# EAGLE schematic i12_TEMPERATURESENSOR-v03(3_4)OHW (EAGLE 6.5.0)
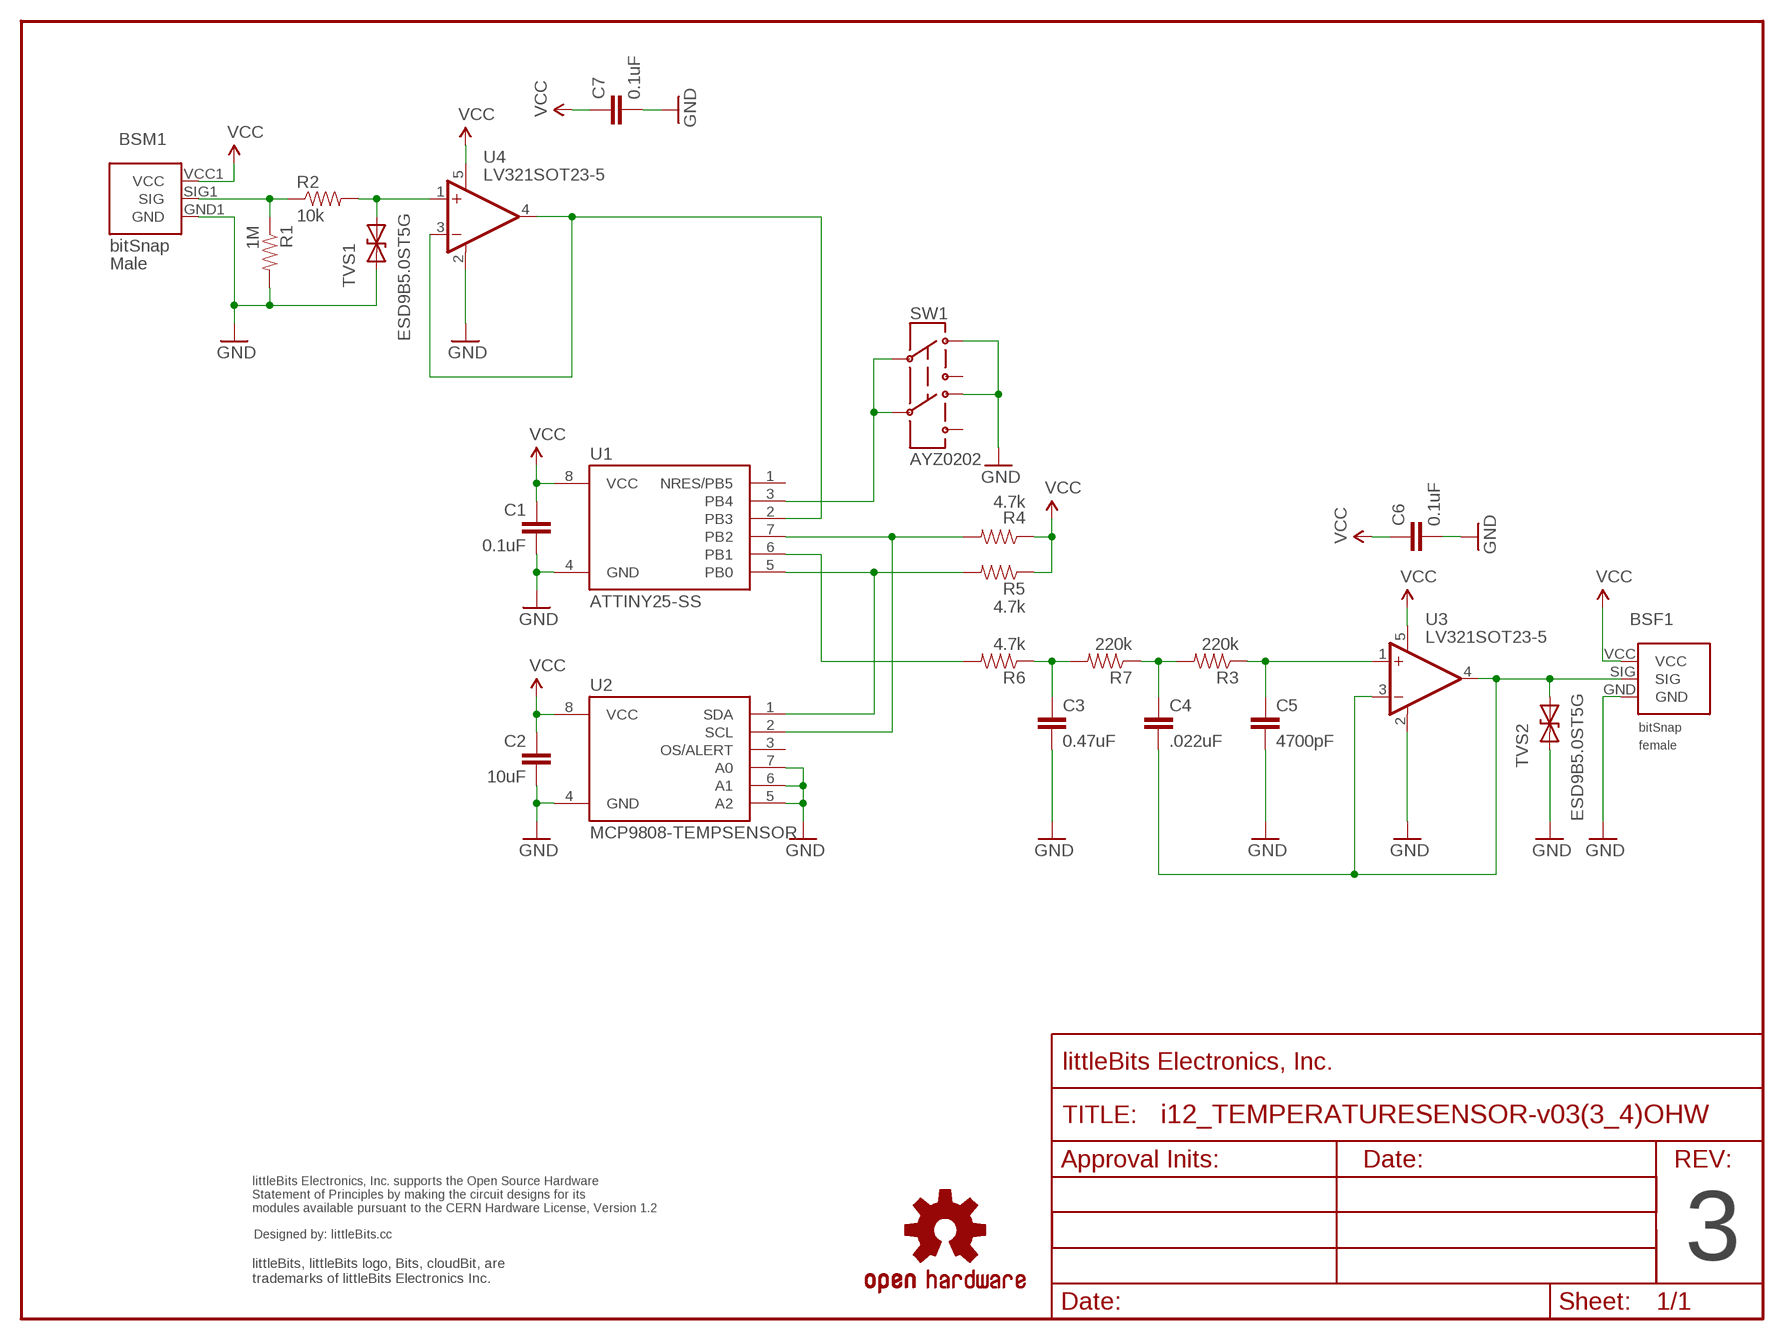
[diagram p0: schematic, sheet 1]

## Parts
BSF1  BITSNAP_V03_FEMALE  [BITSNAP_V03_FEMALE]
BSM1  BITSNAP_V03_MALE  [BITSNAP_V03_MALE]
C1  0.1uF  CAPCAP-0603  [CAP-0603]
C2  10uF  CAPCAP-0603  [CAP-0603]
C3  0.47uF  CAPCAP-0603  [CAP-0603]
C4  .022uF  CAPCAP-0603  [CAP-0603]
C5  4700pF  CAPCAP-0603  [CAP-0603]
C6  0.1uF  CAPCAP-0603  [CAP-0603]
C7  0.1uF  CAPCAP-0603  [CAP-0603]
R1  1M  RESISTOR0603  [RES-0603]
R2  10k  RESISTOR0603  [RES-0603]
R3  220k  RESISTOR0603  [RES-0603]
R4  4.7k  RESISTOR0603  [RES-0603]
R5  4.7k  RESISTOR0603  [RES-0603]
R6  4.7k  RESISTOR0603  [RES-0603]
R7  220k  RESISTOR0603  [RES-0603]
SW1  AYZ0202  [AYZ0202]
TVS1  ESD9B5.0ST5G  DIODE-TVSSOD-923  [SOD-923]
TVS2  ESD9B5.0ST5G  DIODE-TVSSOD-923  [SOD-923]
U1  ATTINY25-SS  [SOIC08_JEDEC_150MIL]
U2  MCP9808-TEMPSENSOR  [MICRO8-ON]
U3  LV321SOT23-5  [SOT23-5]
U4  LV321SOT23-5  [SOT23-5]
U$4  OSHWCREDIT  [OSHWCREDIT]
U$5  OSHW-LOGOL  [OSHW-LOGO-L]
U$33  FRAME-LETTER-OHWOHW  [FABDWG01-OHW]

## Nets
GND: BSF1.GND BSM1.GND1(GND) C1.2 C2.2 C3.2 C5.2 C6.2 C7.2 R1.2 SW1.1 SW1.4 TVS1.1(A) TVS2.1(A) U1.4(GND) U2.4(GND) U2.5(A2) U2.6(A1) U2.7(A0) U3.2(V-) U4.2(V-)
N$1: R6.2 U1.6(PB1)
N$2: SW1.2 SW1.5 U1.3(PB4)
N$3: C3.1 R6.1 R7.2
N$4: R2.2 TVS1.2(C) U4.1(+IN)
N$6: BSM1.SIG1(SIG) R1.1 R2.1
N$8: C4.1 R3.2 R7.1
N$9: C5.1 R3.1 U3.1(+IN)
N$10: R5.2 U1.5(PB0) U2.1(SDA)
N$11: R4.2 U1.7(PB2) U2.2(SCL)
N$14: BSF1.SIG C4.2 TVS2.2(C) U3.3(-IN) U3.4(OUT)
SIG: U1.2(PB3) U4.3(-IN) U4.4(OUT)
VCC: BSF1.VCC BSM1.VCC1(VCC) C1.1 C2.1 C6.1 C7.1 R4.1 R5.1 U1.8(VCC) U2.8(VCC) U3.5(V+) U4.5(V+)
Unconnected: SW1.3 SW1.6 U1.1(NRES/PB5) U2.3(OS/ALERT)

## Notes on the sheet
- 3

## Library data of the parts
BSF1 = bitSnap:BITSNAP_V03_FEMALE
BSM1 = bitSnap:BITSNAP_V03_MALE
C1-C7 = LITTLEBITS:CAP
R1-R7 = LITTLEBITS:RESISTOR
SW1 = LITTLEBITS:AYZ0202
TVS1 TVS2 = LITTLEBITS:DIODE-TVS: Bidirectional Transient Voltage Suppression Diode: Device conducts in avalanche mode after reaching a part dependent voltage threshold. Used for limiting voltage spikes on ESD sensitive inputs and outputs.; IEC_ESD_PROT: +/-18kV; LB_PN: ?; V_CLAMP: ?; V_OPERATION: 5V
U1 = LITTLEBITS:ATTINY25*: ATMEL ATtiny 25 Packages: P = PDIP 08 30mil S = SOIC 08 EIAJ 208mil SS = SOIC 08 JEDEC 150mil Technologies Note: for complete ordering code (temp. range, finish, tape&reel etc.) see www.atmel.com • Supply Voltage: V = (1.8…5.5)V | [blank] = (2.7…5.5)V • Speed: 10 = 10 MHz | 20 = 20 MHz Author: Dipl.-Ing. FH Rainer Bayer HHN Hochschule Heilbronn (Heilbronn University), rainer.bayer@hs-heilbronn.de Ingenieurbüro ing-rb, mail@ing-rb.de
U2 = LITTLEBITS:MCP9808-TEMPSENSOR
U3 U4 = LITTLEBITS:LV321
U$4 = LITTLEBITS:OSHWCREDIT
U$5 = LITTLEBITS:OSHW-LOGO: Open Source Hardware Logo This logo indicates the piece of hardware it is found on incorporates a OSHW license and/or adheres to the definition of open source hardware found here: http://freedomdefined.org/OSHW
U$33 = LITTLEBITS:FRAME-LETTER-OHW